# Altium schematic sheet Overview.SchDoc
size A; SheetNumber: 1; SheetTotal: 15
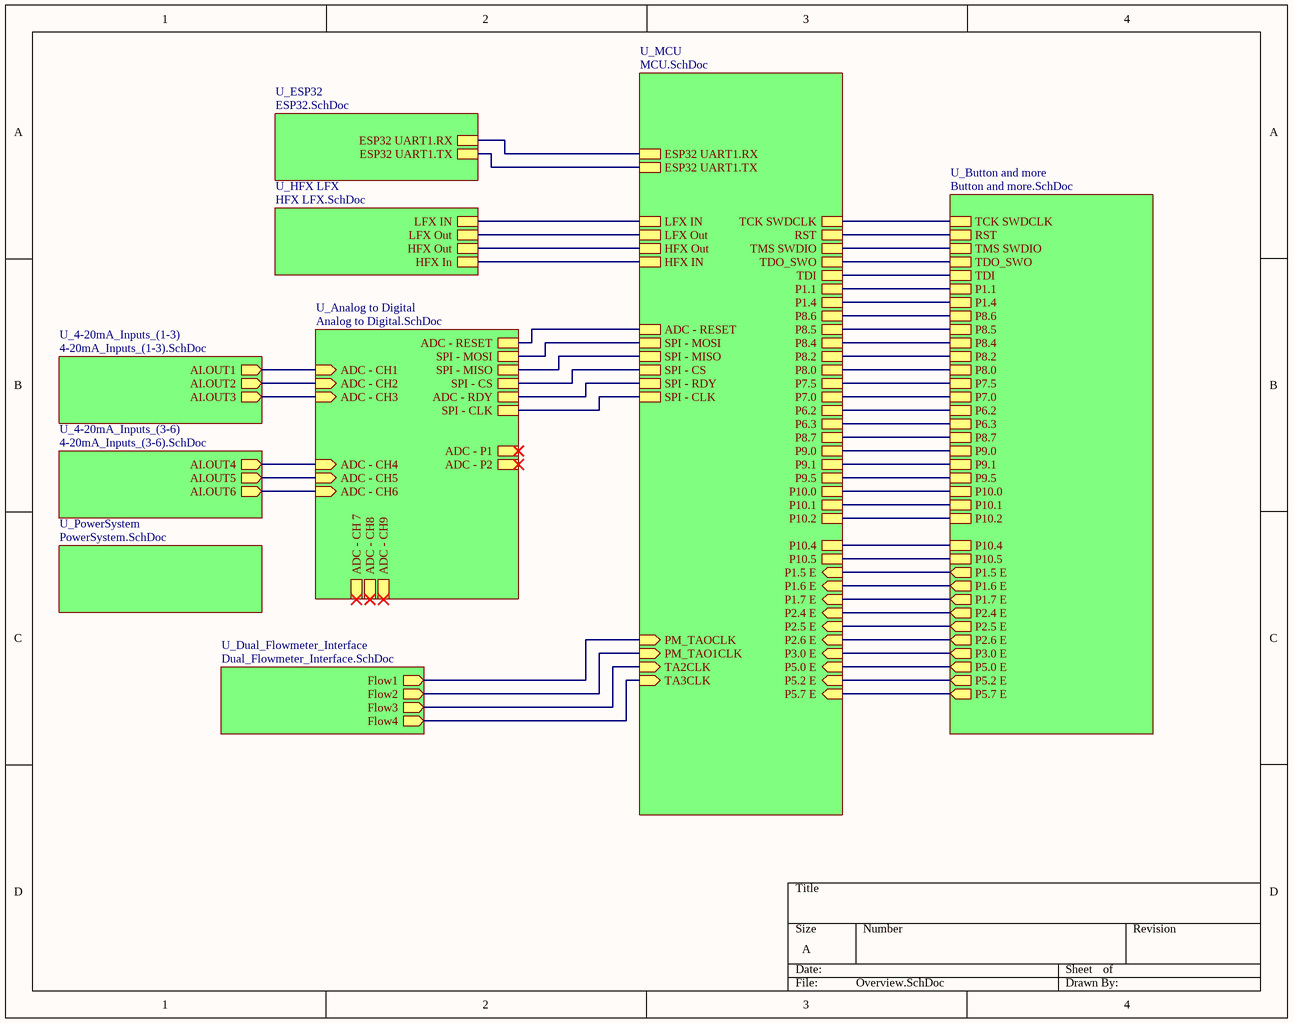
[diagram p0: Overview.SchDoc]

## Sub-sheets
U_4-20mA_Inputs_(1-3) = 4-20mA_Inputs_(1-3).SchDoc: AI.OUT1 (out), AI.OUT2 (out), AI.OUT3 (out)
U_4-20mA_Inputs_(3-6) = 4-20mA_Inputs_(3-6).SchDoc: AI.OUT4 (out), AI.OUT5 (out), AI.OUT6 (out)
U_Analog to Digital = Analog to Digital.SchDoc: ADC - RESET, SPI - MOSI, SPI - MISO, SPI - CS, ADC - CH1 (in), ADC - CH2 (in), ADC - CH3 (in), ADC - CH4 (in), ADC - CH5 (in), ADC - CH6 (in), ADC - CH 7, ADC - CH8, ADC - CH9, ADC - P1, ADC - P2, ADC - RDY, SPI - CLK
U_Button and more = Button and more.SchDoc: P10.5, P10.4, P10.2, P10.1, P10.0, P9.5, P9.1, P9.0, P8.7, P8.6, P8.5, P8.4, P8.2, P8.0, P7.5, P7.0, P6.2, P6.3, TDO_SWO, TDI, TCK SWDCLK, TMS SWDIO, RST, P1.4, P1.1, P1.5 E (out), P2.6 E (out), P2.4 E (out), P2.5 E (out), P3.0 E (out), P1.6 E (out), P1.7 E (out), P5.0 E (out), P5.2 E (out), P5.7 E (out)
U_Dual_Flowmeter_Interface = Dual_Flowmeter_Interface.SchDoc: Flow1 (out), Flow2 (out), Flow3 (out), Flow4 (out)
U_ESP32 = ESP32.SchDoc: ESP32 UART1.TX, ESP32 UART1.RX
U_HFX LFX = HFX LFX.SchDoc: HFX In, HFX Out, LFX Out, LFX IN
U_MCU = MCU.SchDoc: P1.1, TCK SWDCLK, HFX IN, LFX IN, P1.4, ESP32 UART1.RX, ESP32 UART1.TX, LFX Out, HFX Out, RST, TMS SWDIO, P10.5, P10.4, P10.2, P10.1, P10.0, P9.5, P9.1, P9.0, P8.7, P8.6, P8.5, P8.4, TA3CLK (in), P8.2, P8.0, P7.5, P7.0, TDO_SWO, P6.2, P6.3, TA2CLK (in), PM_TAOCLK (in), PM_TAO1CLK (in), P1.5 E (in), P2.6 E (in), P2.4 E (in), P2.5 E (in), P3.0 E (in), P5.7 E (in), P1.6 E (in), P1.7 E (in), P5.0 E (in), P5.2 E (in), TDI, SPI - CLK, SPI - MOSI, SPI - MISO, ADC - RESET, SPI - RDY, SPI - CS
U_PowerSystem = PowerSystem.SchDoc: no entries

## Nets
(unnamed): sheet U_MCU/P1.1, sheet U_Button and more/P1.1
(unnamed): sheet U_MCU/TCK SWDCLK, sheet U_Button and more/TCK SWDCLK
(unnamed): sheet U_MCU/HFX IN, sheet U_HFX LFX/HFX In
(unnamed): sheet U_MCU/LFX IN, sheet U_HFX LFX/LFX IN
(unnamed): sheet U_MCU/P1.4, sheet U_Button and more/P1.4
(unnamed): sheet U_MCU/ESP32 UART1.RX, sheet U_ESP32/ESP32 UART1.RX
(unnamed): sheet U_MCU/ESP32 UART1.TX, sheet U_ESP32/ESP32 UART1.TX
(unnamed): sheet U_MCU/LFX Out, sheet U_HFX LFX/LFX Out
(unnamed): sheet U_MCU/HFX Out, sheet U_HFX LFX/HFX Out
(unnamed): sheet U_MCU/RST, sheet U_Button and more/RST
(unnamed): sheet U_MCU/TMS SWDIO, sheet U_Button and more/TMS SWDIO
(unnamed): sheet U_MCU/P10.5, sheet U_Button and more/P10.5
(unnamed): sheet U_MCU/P10.4, sheet U_Button and more/P10.4
(unnamed): sheet U_MCU/P10.2, sheet U_Button and more/P10.2
(unnamed): sheet U_MCU/P10.1, sheet U_Button and more/P10.1
(unnamed): sheet U_MCU/P10.0, sheet U_Button and more/P10.0
(unnamed): sheet U_MCU/P9.5, sheet U_Button and more/P9.5
(unnamed): sheet U_MCU/P9.1, sheet U_Button and more/P9.1
(unnamed): sheet U_MCU/P9.0, sheet U_Button and more/P9.0
(unnamed): sheet U_MCU/P8.7, sheet U_Button and more/P8.7
(unnamed): sheet U_MCU/P8.6, sheet U_Button and more/P8.6
(unnamed): sheet U_MCU/P8.5, sheet U_Button and more/P8.5
(unnamed): sheet U_MCU/P8.4, sheet U_Button and more/P8.4
(unnamed): sheet U_MCU/TA3CLK, sheet U_Dual_Flowmeter_Interface/Flow4
(unnamed): sheet U_MCU/P8.2, sheet U_Button and more/P8.2
(unnamed): sheet U_MCU/P8.0, sheet U_Button and more/P8.0
(unnamed): sheet U_MCU/P7.5, sheet U_Button and more/P7.5
(unnamed): sheet U_MCU/P7.0, sheet U_Button and more/P7.0
(unnamed): sheet U_MCU/TDO_SWO, sheet U_Button and more/TDO_SWO
(unnamed): sheet U_MCU/P6.2, sheet U_Button and more/P6.2
(unnamed): sheet U_MCU/P6.3, sheet U_Button and more/P6.3
(unnamed): sheet U_MCU/TA2CLK, sheet U_Dual_Flowmeter_Interface/Flow3
(unnamed): sheet U_MCU/PM_TAOCLK, sheet U_Dual_Flowmeter_Interface/Flow1
(unnamed): sheet U_MCU/PM_TAO1CLK, sheet U_Dual_Flowmeter_Interface/Flow2
(unnamed): sheet U_MCU/P1.5 E, sheet U_Button and more/P1.5 E
(unnamed): sheet U_MCU/P2.6 E, sheet U_Button and more/P2.6 E
(unnamed): sheet U_MCU/P2.4 E, sheet U_Button and more/P2.4 E
(unnamed): sheet U_MCU/P2.5 E, sheet U_Button and more/P2.5 E
(unnamed): sheet U_MCU/P3.0 E, sheet U_Button and more/P3.0 E
(unnamed): sheet U_MCU/P5.7 E, sheet U_Button and more/P5.7 E
(unnamed): sheet U_MCU/P1.6 E, sheet U_Button and more/P1.6 E
(unnamed): sheet U_MCU/P1.7 E, sheet U_Button and more/P1.7 E
(unnamed): sheet U_MCU/P5.0 E, sheet U_Button and more/P5.0 E
(unnamed): sheet U_MCU/P5.2 E, sheet U_Button and more/P5.2 E
(unnamed): sheet U_MCU/TDI, sheet U_Button and more/TDI
(unnamed): sheet U_MCU/SPI - CLK, sheet U_Analog to Digital/SPI - CLK
(unnamed): sheet U_MCU/SPI - MOSI, sheet U_Analog to Digital/SPI - MOSI
(unnamed): sheet U_MCU/SPI - MISO, sheet U_Analog to Digital/SPI - MISO
(unnamed): sheet U_MCU/ADC - RESET, sheet U_Analog to Digital/ADC - RESET
(unnamed): sheet U_MCU/SPI - RDY, sheet U_Analog to Digital/ADC - RDY
(unnamed): sheet U_MCU/SPI - CS, sheet U_Analog to Digital/SPI - CS
(unnamed): sheet U_Analog to Digital/ADC - CH1, sheet U_4-20mA_Inputs_(1-3)/AI.OUT1
(unnamed): sheet U_Analog to Digital/ADC - CH2, sheet U_4-20mA_Inputs_(1-3)/AI.OUT2
(unnamed): sheet U_Analog to Digital/ADC - CH3, sheet U_4-20mA_Inputs_(1-3)/AI.OUT3
(unnamed): sheet U_Analog to Digital/ADC - CH4, sheet U_4-20mA_Inputs_(3-6)/AI.OUT4
(unnamed): sheet U_Analog to Digital/ADC - CH5, sheet U_4-20mA_Inputs_(3-6)/AI.OUT5
(unnamed): sheet U_Analog to Digital/ADC - CH6, sheet U_4-20mA_Inputs_(3-6)/AI.OUT6